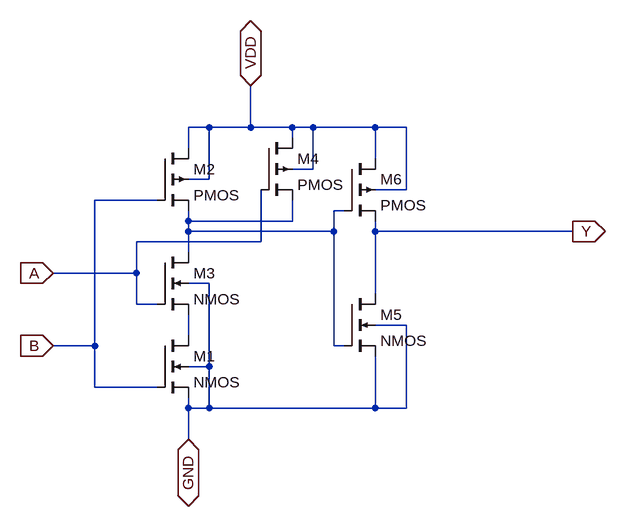
[diagram p0: schematic AND.asc]
AND.asc, the LTspice schematic file:
Version 4
SHEET 1 880 680
WIRE 208 -80 176 -80
WIRE 272 -80 272 -144
WIRE 272 -80 208 -80
WIRE 336 -80 272 -80
WIRE 368 -80 336 -80
WIRE 464 -80 368 -80
WIRE 512 -80 464 -80
WIRE 336 -64 336 -80
WIRE 176 -48 176 -80
WIRE 464 -32 464 -80
WIRE 368 -16 368 -80
WIRE 368 -16 336 -16
WIRE 208 0 208 -80
WIRE 208 0 176 0
WIRE 512 16 512 -80
WIRE 512 16 464 16
WIRE 128 32 32 32
WIRE 416 48 400 48
WIRE 176 64 176 48
WIRE 336 64 336 32
WIRE 336 64 176 64
WIRE 176 80 176 64
WIRE 400 80 400 48
WIRE 400 80 176 80
WIRE 464 80 464 64
WIRE 768 80 464 80
WIRE 288 96 288 16
WIRE 288 96 96 96
WIRE 176 112 176 80
WIRE 96 144 96 96
WIRE 96 144 -32 144
WIRE 208 160 176 160
WIRE 464 176 464 80
WIRE 96 192 96 144
WIRE 128 192 96 192
WIRE 512 224 464 224
WIRE 176 240 176 208
WIRE 32 256 32 32
WIRE 32 256 -32 256
WIRE 400 256 400 80
WIRE 416 256 400 256
WIRE 208 288 208 160
WIRE 208 288 176 288
WIRE 32 320 32 256
WIRE 128 320 32 320
WIRE 176 352 176 336
WIRE 208 352 208 288
WIRE 208 352 176 352
WIRE 464 352 464 272
WIRE 464 352 208 352
WIRE 512 352 512 224
WIRE 512 352 464 352
WIRE 176 400 176 352
FLAG 176 400 GND
IOPIN 176 400 BiDir
FLAG -32 144 A
IOPIN -32 144 In
FLAG -32 256 B
IOPIN -32 256 In
FLAG 768 80 Y
IOPIN 768 80 Out
FLAG 272 -144 VDD
IOPIN 272 -144 BiDir
SYMBOL nmos4 128 240 R0
SYMATTR InstName M1
SYMATTR Value2 l=180n w=2u
SYMBOL pmos4 128 -48 R0
SYMATTR InstName M2
SYMATTR Value2 l=180n w=220n
SYMBOL nmos4 128 112 R0
SYMATTR InstName M3
SYMATTR Value2 l=180n w=2u
SYMBOL pmos4 288 -64 R0
SYMATTR InstName M4
SYMATTR Value2 l=180n w=220n
SYMBOL nmos4 416 176 R0
SYMATTR InstName M5
SYMATTR Value2 l=180n w=220n
SYMBOL pmos4 416 -32 R0
SYMATTR InstName M6
SYMATTR Value2 l=180n w=220n

The netlist it stands for:
* AND.asc
M1 N002 B GND GND NMOS l=180n w=2u
M2 VDD B N001 VDD PMOS l=180n w=220n
M3 N001 A N002 GND NMOS l=180n w=2u
M4 VDD A N001 VDD PMOS l=180n w=220n
M5 Y N001 GND GND NMOS l=180n w=220n
M6 VDD N001 Y VDD PMOS l=180n w=220n
.model NMOS NMOS
.model PMOS PMOS
.lib standard.mos
.backanno
.end